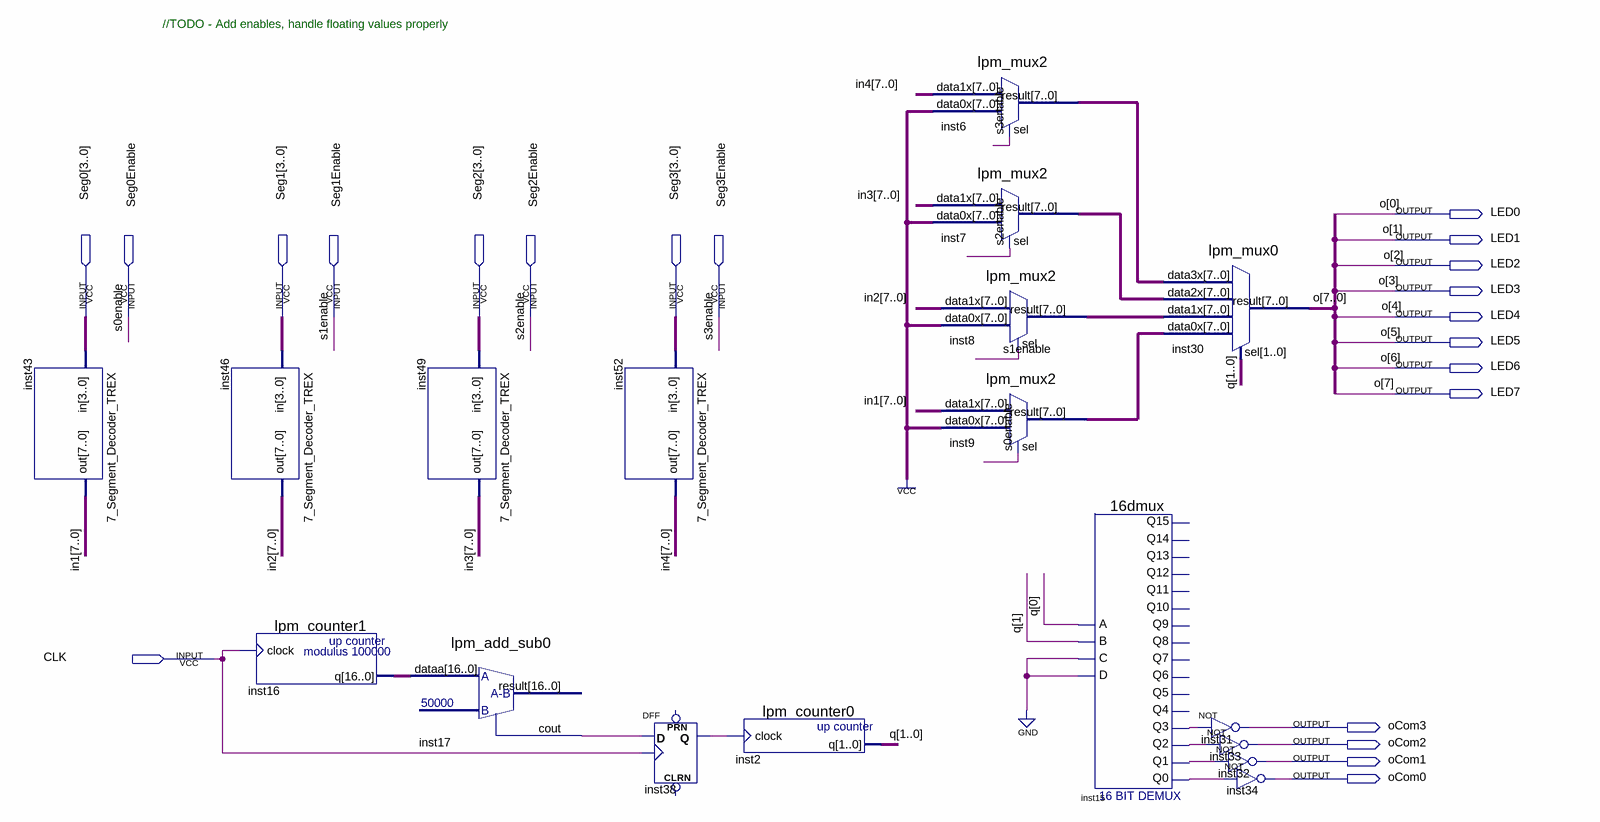
[diagram p0: schematic sheet]
// Quartus schematic MultiPlexed7Seg.bdf as structural Verilog: 18 symbols, 21 pins
module MultiPlexed7Seg (
  input  [3:0] Seg0,
  input  Seg0Enable,
  input  [3:0] Seg1,
  input  Seg1Enable,
  input  [3:0] Seg2,
  input  Seg2Enable,
  input  [3:0] Seg3,
  input  Seg3Enable,
  input  CLK,
  output LED0,
  output LED1,
  output LED2,
  output LED3,
  output LED4,
  output LED5,
  output LED6,
  output LED7,
  output oCom3,
  output oCom2,
  output oCom1,
  output oCom0
);

  wire inst15_q0, inst15_q1, inst15_q2, inst15_q3, inst17_cout, inst38_q;
  wire [1:0] q;
  wire [7:0] in1, in2, in3, in4, inst6_result, inst7_result, inst8_result, inst9_result;
  wire [16:0] inst16_q;

  \7_Segment_Decoder_TREX  inst43 (.in(Seg0), .out(in1));
  \7_Segment_Decoder_TREX  inst46 (.in(Seg1), .out(in2));
  lpm_counter1 inst16 (.clock(CLK), .q(inst16_q));
  \7_Segment_Decoder_TREX  inst49 (.in(Seg2), .out(in3));
  lpm_add_sub0 inst17 (.dataa(inst16_q), .cout(inst17_cout));  // open: result
  \7_Segment_Decoder_TREX  inst52 (.in(Seg3), .out(in4));
  DFF inst38 (.CLK(CLK), .D(inst17_cout), .Q(inst38_q));  // open: CLRN, PRN
  lpm_counter0 inst2 (.clock(inst38_q), .q(q));
  lpm_mux2 inst6 (.data1x(in4), .data0x({8{1'b1}}), .sel(Seg3Enable), .result(inst6_result));
  lpm_mux2 inst7 (.data1x(in3), .data0x({8{1'b1}}), .sel(Seg2Enable), .result(inst7_result));
  lpm_mux2 inst8 (.data1x(in2), .data0x({8{1'b1}}), .sel(Seg1Enable), .result(inst8_result));
  lpm_mux2 inst9 (.data1x(in1), .data0x({8{1'b1}}), .sel(Seg0Enable), .result(inst9_result));
  \16dmux  inst15 (
    .C(1'b0), .B(q[1]), .A(q[0]), .D(1'b0), .Q2(inst15_q2), .Q3(inst15_q3), .Q0(inst15_q0), .Q1(inst15_q1));  // open: Q12, Q13, Q11, Q9, Q10, Q7, Q8, Q4, Q5, Q6, Q14, Q15
  lpm_mux0 inst30 (
    .data3x(inst6_result), .data2x(inst7_result), .data1x(inst8_result), .data0x(inst9_result), .sel(q),
    .result({LED7, LED6, LED5, LED4, LED3, LED2, LED1, LED0}));
  not inst31 (oCom3, inst15_q3);
  not inst33 (oCom2, inst15_q2);
  not inst32 (oCom1, inst15_q1);
  not inst34 (oCom0, inst15_q0);

  // Other names for the same wires on the sheet: o[7:0] = {LED7, LED6, LED5, LED4, LED3, LED2, LED1, LED0};
  //   s0enable = Seg0Enable; s1enable = Seg1Enable; s2enable = Seg2Enable; s3enable = Seg3Enable

  // Notes on the sheet:
  //   //TODO - Add enables, handle floating values properly
endmodule
